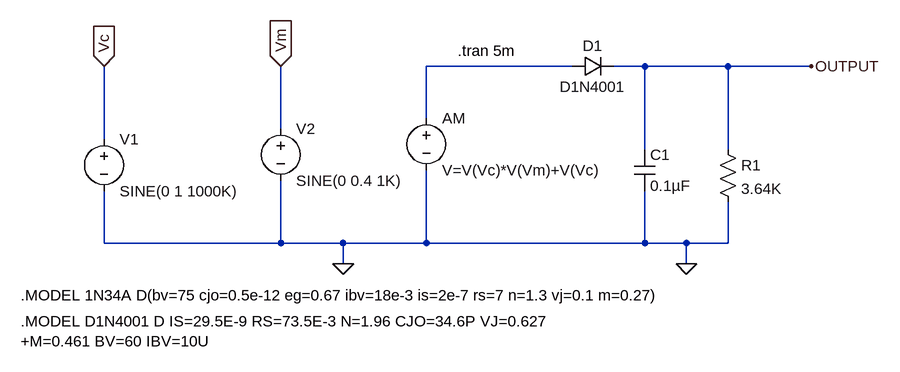
[diagram p0: schematic Envolupe_Detector_CE_config.asc]
Envolupe_Detector_CE_config.asc, the LTspice schematic file:
Version 4
SHEET 1 1052 692
WIRE 448 128 224 128
WIRE 560 128 512 128
WIRE 688 128 560 128
WIRE 816 128 688 128
WIRE 224 208 224 128
WIRE 0 224 0 128
WIRE -272 240 -272 128
WIRE 560 256 560 128
WIRE 688 256 688 128
WIRE -272 400 -272 320
WIRE 0 400 0 304
WIRE 0 400 -272 400
WIRE 96 400 0 400
WIRE 224 400 224 288
WIRE 224 400 96 400
WIRE 560 400 560 320
WIRE 560 400 224 400
WIRE 624 400 560 400
WIRE 688 400 688 336
WIRE 688 400 624 400
WIRE 96 432 96 400
WIRE 624 432 624 400
FLAG 624 432 0
FLAG 816 128 OUTPUT
FLAG 0 128 Vm
IOPIN 0 128 In
FLAG -272 128 Vc
IOPIN -272 128 In
FLAG 96 432 0
SYMBOL cap 544 256 R0
SYMATTR InstName C1
SYMATTR Value 0.1µF
SYMBOL res 672 240 R0
SYMATTR InstName R1
SYMATTR Value 3.64K
SYMBOL voltage -272 224 R0
WINDOW 123 0 0 Left 0
WINDOW 39 0 0 Left 0
SYMATTR InstName V1
SYMATTR Value SINE(0 1 1000K)
SYMBOL voltage 0 208 R0
WINDOW 123 0 0 Left 0
WINDOW 39 0 0 Left 0
SYMATTR InstName V2
SYMATTR Value SINE(0 0.4 1K)
SYMBOL voltage 224 192 R0
SYMATTR InstName AM
SYMATTR Value V=V(Vc)*V(Vm)+V(Vc)
SYMATTR Prefix B
SYMBOL diode 448 144 R270
WINDOW 0 32 32 VTop 2
WINDOW 3 0 32 VBottom 2
SYMATTR InstName D1
SYMATTR Value D1N4001
TEXT 272 104 Left 2 !.tran 5m
TEXT -400 480 Left 2 !.MODEL 1N34A D(bv=75 cjo=0.5e-12 eg=0.67 ibv=18e-3 is=2e-7 rs=7 n=1.3 vj=0.1 m=0.27)
TEXT -400 520 Left 2 !.MODEL D1N4001 D IS=29.5E-9 RS=73.5E-3 N=1.96 CJO=34.6P VJ=0.627\n+M=0.461 BV=60 IBV=10U

The netlist it stands for:
* Envolupe_Detector_CE_config.asc
C1 OUTPUT 0 0.1µF
R1 OUTPUT 0 3.64K
V1 Vc 0 SINE(0 1 1000K)
V2 Vm 0 SINE(0 0.4 1K)
B§AM N001 0 V=V(Vc)*V(Vm)+V(Vc)
D1 N001 OUTPUT D1N4001
.model D D
.lib standard.dio
.tran 5m
.MODEL 1N34A D(bv=75 cjo=0.5e-12 eg=0.67 ibv=18e-3 is=2e-7 rs=7 n=1.3 vj=0.1 m=0.27)
.MODEL D1N4001 D IS=29.5E-9 RS=73.5E-3 N=1.96 CJO=34.6P VJ=0.627
+M=0.461 BV=60 IBV=10U
.backanno
.end